# EAGLE design InrushTimer (EAGLE 7.7.0)
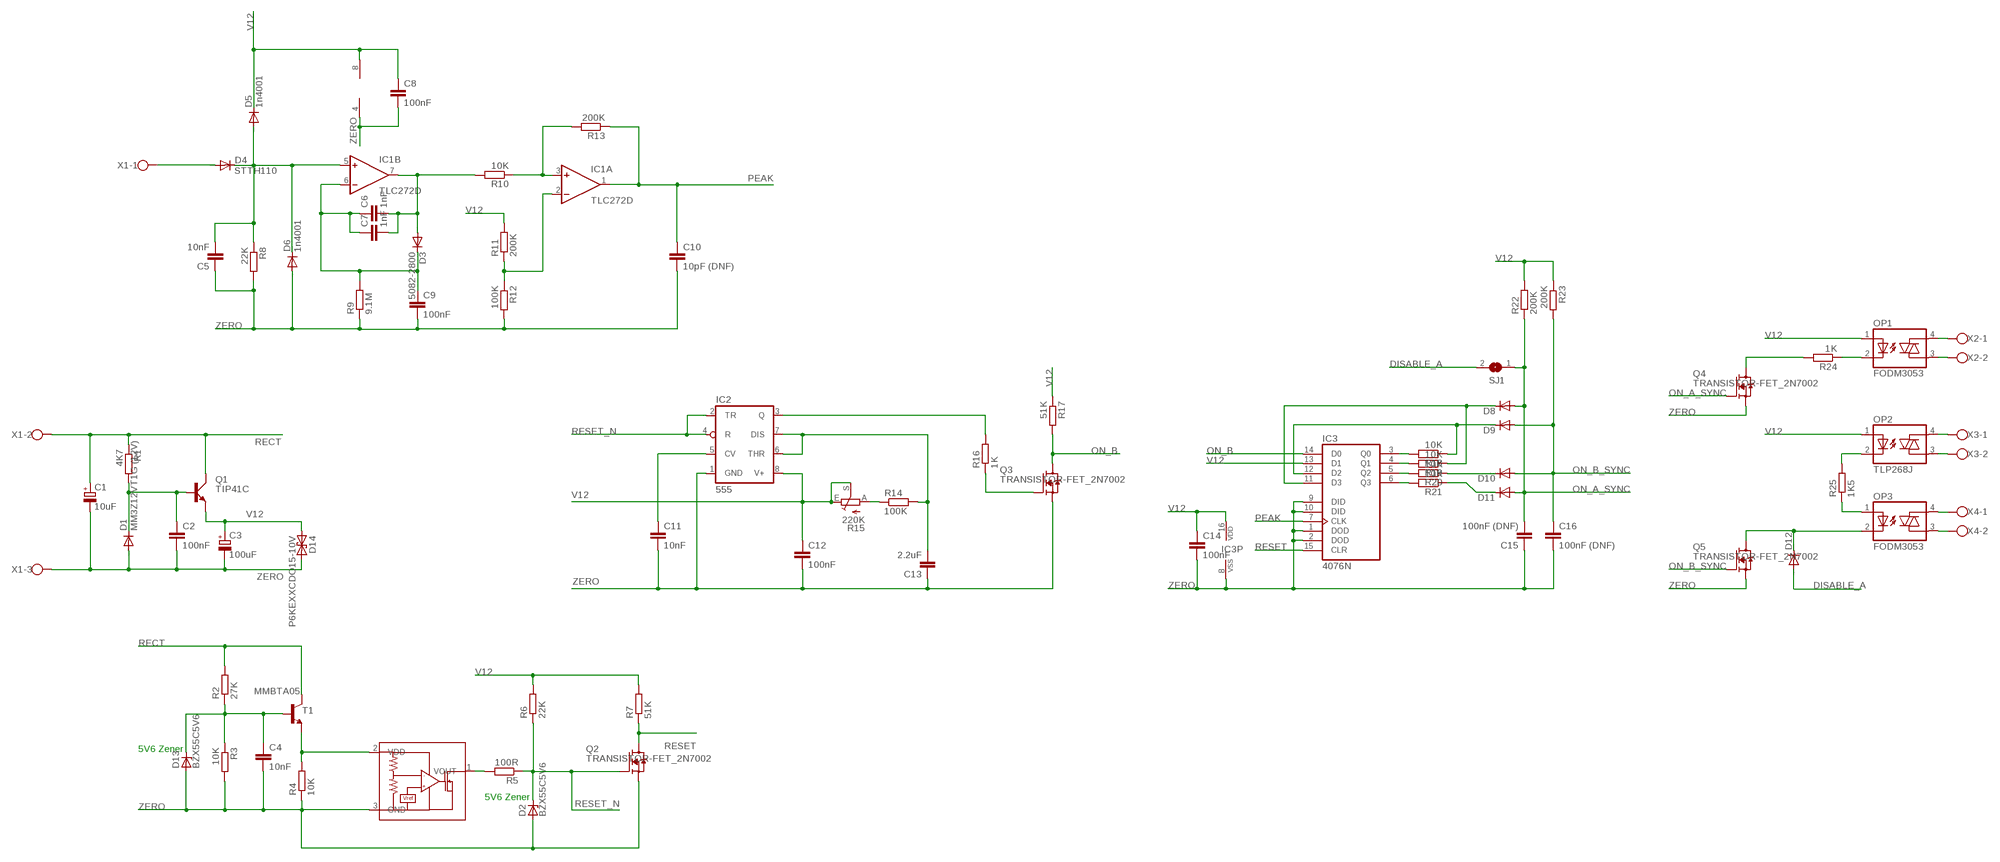
[diagram p0: schematic, sheet 1]

## Parts
C1  10uF  CPOL-EUE2-5  [E2-5]
C2  100nF  C-EU050-024X044  [C050-024X044]
C3  100uF  CPOL-EUE2.5-7  [E2,5-7]
C4  10nF  C-EU050-024X044  [C050-024X044]
C5  10nF  C-EUC0805K  [C0805K]
C6  1nF  C-EUC0805K  [C0805K]
C7  1nF  C-EUC0805K  [C0805K]
C8  100nF  C-EUC0805  [C0805]
C9  100nF  C-EUC1206K  [C1206K]
C10  10pF (DNF)  C-EUC0805K  [C0805K]
C11  10nF  C-EU050-024X044  [C050-024X044]
C12  100nF  C-EU050-024X044  [C050-024X044]
C13  2.2uF  C-EUC1206K  [C1206K]
C14  100nF  C-EU050-024X044  [C050-024X044]
C15  100nF (DNF)  C-EUC1206K  [C1206K]
C16  100nF (DNF)  C-EUC1206K  [C1206K]
D1  MM3Z12VT1G (12V)  DIODE-SOD323-R  [SOD323-R]
D2  BZX55C5V6  ZENER-DIODEDO34-7  [DO34Z7]
D3  5082-2800  DIODE-DO34-7  [DO34-7]
D4  STTH110  DIODE-DO41-7.6  [DO41-7.6]
D5  1n4001  DIODE-DO41-10VN  [DO41-10VN]
D6  1n4001  DIODE-DO41-7.6  [DO41-7.6]
D8  1N4148DO35-10  [DO35-10]
D9  1N4148DO35-7  [DO35-7]
D10  1N4148DO35-7  [DO35-7]
D11  1N4148DO35-7  [DO35-7]
D12  1N4148DO35-7  [DO35-7]
D13  BZX55C5V6  ZENER-DIODEDO34-7  [DO34Z7]
D14  P6KEXXCDO15-10V  [DO15-10V]
IC1  TLC272D  [SO08]
IC2  555  [SO08-555]
IC3  4076N  [DIL16]
OP1  FODM3053  [FODM]
OP2  TLP268J  [TLP26*]
OP3  FODM3053  [FODM]
Q1  TIP41C  [TO220AV]
Q2  TRANSISTOR-FET_2N7002  [TRANSISTOR-FET_SOT23]
Q3  TRANSISTOR-FET_2N7002  [TRANSISTOR-FET_SOT23]
Q4  TRANSISTOR-FET_2N7002  [TRANSISTOR-FET_SOT23]
Q5  TRANSISTOR-FET_2N7002  [TRANSISTOR-FET_SOT23]
R1  4K7  R-EU_0207/2V  [0207/2V]
R2  27K  R-EU_0207/7  [0207/7]
R3  10K  R-EU_0207/2V  [0207/2V]
R4  10K  R-EU_R0805  [R0805]
R5  100R  R-EU_0207/7  [0207/7]
R6  22K  R-EU_0207/2V  [0207/2V]
R7  51K  R-EU_0207/2V  [0207/2V]
R8  22K  R-EU_0207/2V  [0207/2V]
R9  9.1M  R-EU_0207/7  [0207/7]
R10  10K  R-EU_0207/10  [0207/10]
R11  200K  R-EU_0207/2V  [0207/2V]
R12  100K  R-EU_0207/2V  [0207/2V]
R13  200K  R-EU_0207/2V  [0207/2V]
R14  100K  R-EU_0207/2V  [0207/2V]
R15  220K  TRIM_EU-CA6H  [CA6H]
R16  1K  R-EU_R0402  [R0402]
R17  51K  R-EU_0207/2V  [0207/2V]
R18  10K  R-EU_R0805  [R0805]
R19  10K  R-EU_R0805  [R0805]
R20  10K  R-EU_R0805  [R0805]
R21  10K  R-EU_R0805  [R0805]
R22  200K  R-EU_0207/2V  [0207/2V]
R23  200K  R-EU_0207/7  [0207/7]
R24  1K  R-EU_0207/7  [0207/7]
R25  1K5  R-EU_0207/2V  [0207/2V]
SJ1  SJ  [SJ]
T1  MMBTA05  MMBTA42LT1-NPN-SOT23-BEC  [SOT23-BEC]
U1  ROHM_BY_ELEMENT14_BATCH_1_BU48XXG  [ROHM_BY_ELEMENT14_BATCH_1_SOT95P280X125-5N]
X1  W237-103  [W237-103]
X2  W237-102  [W237-102]
X3  W237-102  [W237-102]
X4  W237-102  [W237-102]

## Nets
DISABLE_A: D12.A SJ1.2
N$1: D4.A X1.1
N$2: R14.1 R15.A
N$3: IC3.6(Q3) R21.2
N$4: OP3.4(A2) X4.1
N$5: OP1.3(A1) X2.2
N$6: D12.C OP3.2(C) Q5.3(D)
N$7: C6.2 C7.2 D3.A IC1.7(B:OUT) R10.2
N$8: C2.1 D1.C Q1.B R1.2
N$9: C6.1 C7.1 C9.1 D3.C IC1.6(B:-IN) R9.2
N$10: OP1.4(A2) X2.1
N$11: C5.2 D4.C D5.A D6.C IC1.5(B:+IN) R8.1
N$12: OP3.3(A1) X4.2
N$13: R4.2 T1.E U1.2(VDD)
N$14: C4.1 D13.C R2.1 R3.1 T1.B
N$15: OP3.1(A) R25.1
N$16: D9.C IC3.12(D2) R18.1
N$17: OP2.2(C) R25.2
N$18: OP1.2(C) R24.1
N$19: IC3.5(Q2) R20.2
N$20: OP2.4(A2) X3.1
N$21: OP2.3(A1) X3.2
N$22: D8.C IC3.11(D3) R19.1
N$23: R5.2 U1.1(VOUT)
N$24: D11.C R21.1
N$25: IC3.4(Q1) R19.2
N$26: IC1.3(A:+IN) R10.1 R13.2
N$28: C13.2 IC2.6(THR) IC2.7(DIS) R14.2
N$30: D10.C R20.1
N$31: Q4.3(D) R24.2
N$32: IC3.3(Q0) R18.2
N$36: Q3.1(G) R16.1
N$40: C11.1 IC2.5(CV)
N$48: IC2.3(Q) R16.2
ON_A_SYNC: C15.2 D8.A D11.A Q4.1(G) R22.1 SJ1.1
ON_B: IC3.14(D0) Q3.3(D) R17.2
ON_B_SYNC: C16.1 D9.A D10.A Q5.1(G) R23.2
PEAK: C10.1 IC1.1(A:OUT) IC3.7(CLK) R13.1
RECT: C1.+ Q1.C R1.1 R2.2 T1.C X1.2
RESET: IC3.15(CLR) Q2.3(D) R7.1
RESET_N: D2.C IC2.2(TR) IC2.4(R) Q2.1(G) R5.1 R6.1
THRESH: IC1.2(A:-IN) R11.1 R12.1
V12: C3.+ C8.1 C12.1 C14.1 D5.C D14.A IC1.8(P:V+) IC2.8(V+) IC3.13(D1) IC3.16(VDD) OP1.1(A) OP2.1(A) Q1.E R6.2 R7.2 R11.2 R15.E R15.S R17.1 R22.2 R23.1
ZERO: C1.- C2.2 C3.- C4.2 C5.1 C8.2 C9.2 C10.2 C11.2 C12.2 C13.1 C14.2 C15.1 C16.2 D1.A D2.A D6.A D13.A D14.C IC1.4(P:V-) IC2.1(GND) IC3.1(DOD) IC3.2(DOD) IC3.8(VSS) IC3.9(DID) IC3.10(DID) Q2.2(S) Q3.2(S) Q4.2(S) Q5.2(S) R3.2 R4.1 R8.2 R9.1 R12.2 U1.3(GND) X1.3

## Notes on the sheet
- 5V6 Zener
- 5V6 Zener

## Library data of the parts
C1 C3 = rcl:CPOL-EU: POLARIZED CAPACITOR, European symbol
C2 C4-C16 = rcl:C-EU: CAPACITOR, European symbol
D1 D3-D6 = diode:DIODE-: DIODE
D2 D13 = diode:ZENER-DIODE: Z-Diode
D8-D12 = diode:1N4148: DIODE high speed (Philips)
D14 = diode:P6KEXXC: DIODE transient-voltage suppressor
IC1 = linear:TLC272: OP AMP
IC2 = linear:*555: TIMER
IC3 = 40xx:4076: Quad D-type REGISTER
OP1 OP3 = SHoleLib:FODM3053
OP2 = SHoleLib:TLP268J
Q1 = transistor-power:TIP41C: NPN TRANSISTOR
Q2-Q5 = InrushTimer:TRANSISTOR-FET_2N7002
R1-R14 R16-R25 = rcl:R-EU_: RESISTOR, European symbol
R15 = pot:TRIM_EU-: POTENTIOMETER
SJ1 = jumper:SJ: SMD solder JUMPER
T1 = transistor:*-NPN-: NPN Transistror BF959 corrected 2008.03.06
U1 = InrushTimer:ROHM_BY_ELEMENT14_BATCH_1_BU48XXG
X1 = con-wago-500:W237-103: WAGO SCREW CLAMP; MPN: 237-103; OC_FARNELL: unknown; OC_NEWARK: 18M7116
X2-X4 = con-wago-500:W237-102: WAGO SCREW CLAMP; MPN: 237-102; OC_FARNELL: unknown; OC_NEWARK: 70K9898

## Net classes
1 Power: width 1.27 mm, clearance 0.381 mm
3 Ground: width 0.318 mm, clearance 0.381 mm

## Board
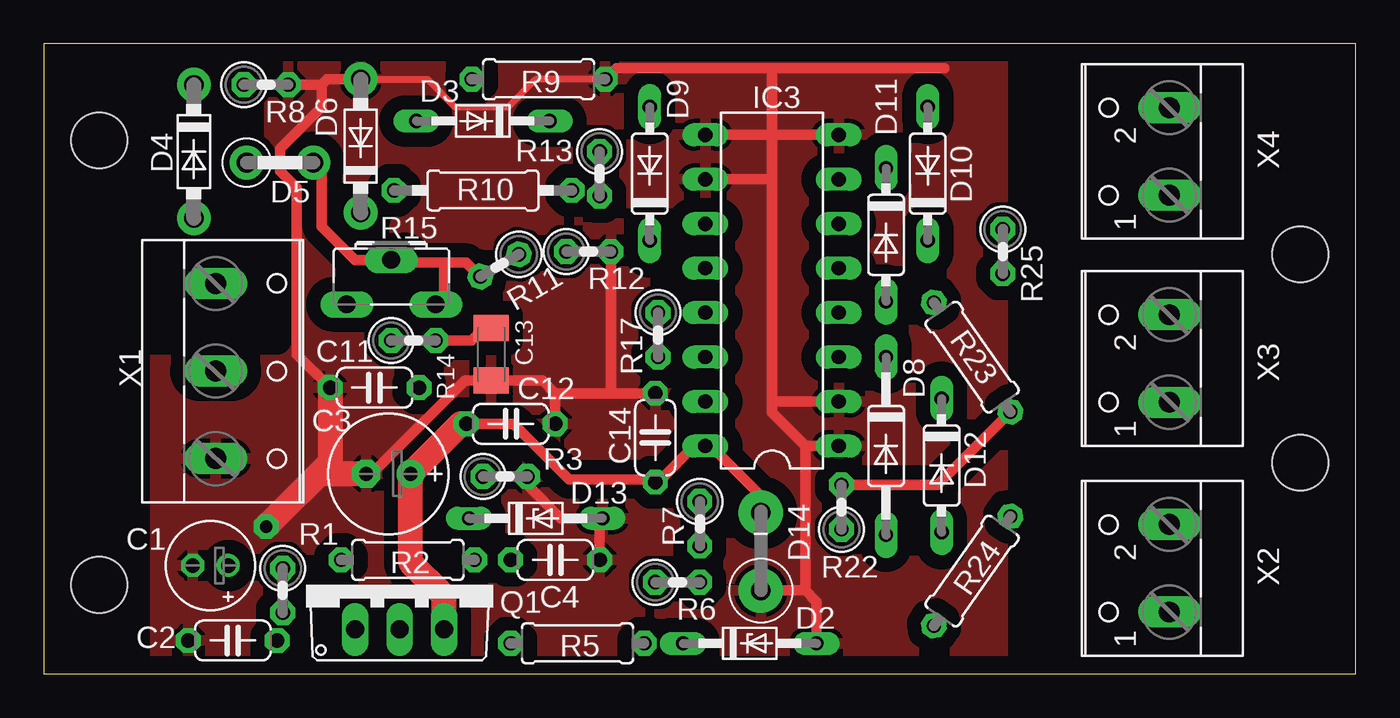
[diagram p1: board, top side]
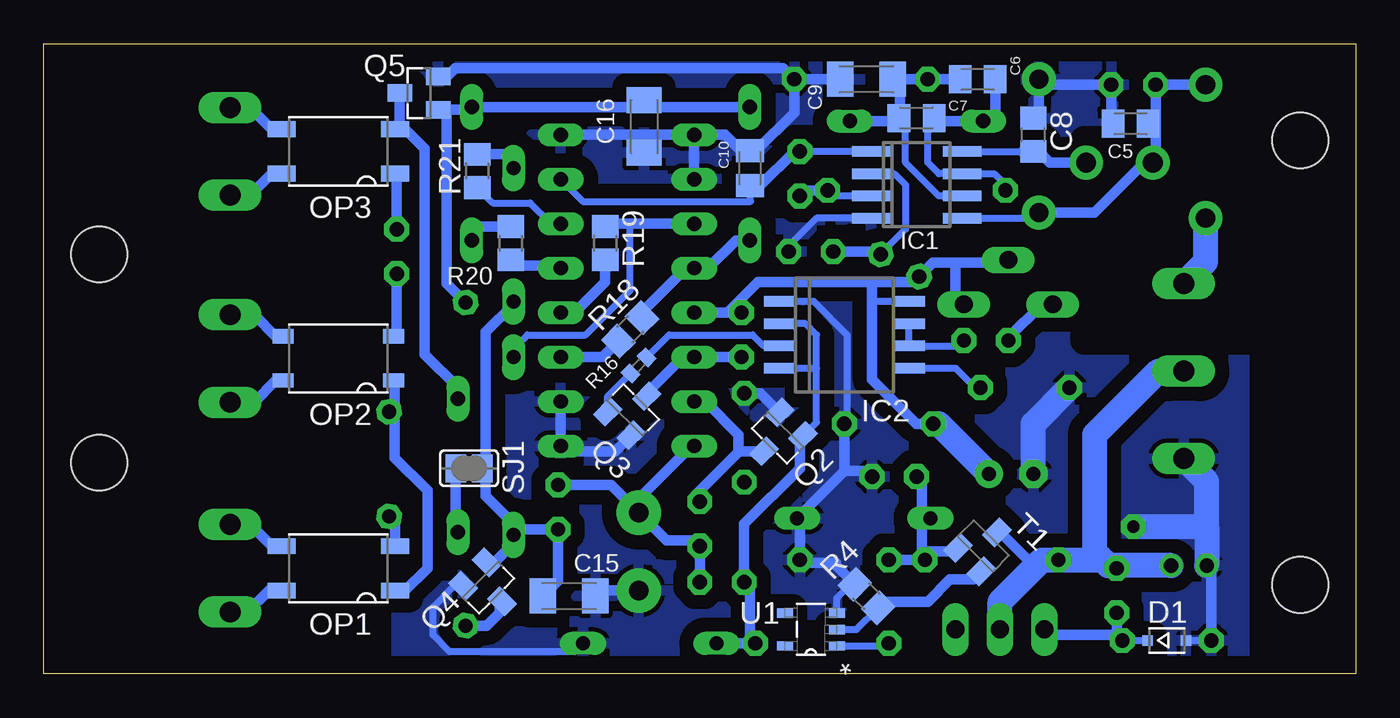
[diagram p2: board, bottom side, seen from below]

Size 74.93 x 36 mm. Coordinates in mm from the lower left corner, seen from the top.
Outline: 0,0 74.93,0 74.93,36 0,36 0,0
Copper layers (1*16): Top 0.035mm / dielectric 1.5mm / Bottom 0.035mm
Design rules "default *": minimum track width 16mil, minimum drill 24mil, track to track 16mil, track to pad 16mil, pad to pad 16mil, via to via 16mil, smd to smd 12.5mil, copper to edge 40mil, drill to drill 8mil, minimum pad ring 10mil, minimum via ring 8mil, stop-mask expansion 4mil, vias tented up to drill 0mil, thermal gap 10mil
Holes 3.2 mm at 71.75,12.06 71.75,23.97 3.17,30.48 3.17,5.08
tRestrict: area 55.9,0 to 68.6,36; area 6.3,27.9 to 11.7,36; area 6.4,19.1 to 13.3,27.9
bRestrict: area 55.9,0 to 68.6,36; area 6.4,19.1 to 15.5,30.5

### Footprints (pad centres in the part's own frame; a part is rotated, then mirrored left to right if it is on the bottom)
E2-5 = drill 0.813 pad 1.27: + -1.016,0 | drill 0.813 pad 1.27 octagon: - 1.016,0
C050-024X044 = drill 0.813 pad 1.422 octagon: 1 -2.54,0; 2 2.54,0
E2,5-7 = drill 0.813 pad 1.6: + -1.27,0 | drill 0.813 pad 1.6 octagon: - 1.27,0
C0805K = smd 1.3 x 1.6: 1 -1,0; 2 1,0
C0805 = smd 1.3 x 1.5: 1 -0.95,0; 2 0.95,0
C1206K = smd 1.5 x 2: 1 -1.5,0; 2 1.5,0
SOD323-R = smd 0.6 x 0.6: A 1.1,0; C -1.1,0
DO34Z7 = drill 0.813 long: A 3.81,0; C -3.81,0
DO34-7 = drill 0.813 long: A 3.81,0; C -3.81,0
DO41-7.6 = drill 1.1 pad 1.93: A 3.81,0; C -3.81,0
DO41-10VN = drill 1.118 pad 1.93: A 1.905,0; C -1.905,0
DO35-10 = drill 0.813 long: A 5.08,0; C -5.08,0
DO35-7 = drill 0.813 long: A 3.81,0; C -3.81,0
DO15-10V = drill 1.118 pad 2.54: A 2.223,0; C -2.223,0
SO08 = smd 0.6 x 2.2: 1 -1.905,-2.6; 2 -0.635,-2.6; 3 0.635,-2.6; 4 1.905,-2.6; 5 1.905,2.6; 6 0.635,2.6; 7 -0.635,2.6; 8 -1.905,2.6
SO08-555 = smd 0.6 x 1.8: 1 -1.905,-3.7; 2 -0.635,-3.7; 3 0.635,-3.7; 4 1.905,-3.7; 5 1.905,3.7; 6 0.635,3.7; 7 -0.635,3.7; 8 -1.905,3.7
DIL16 = drill 0.813 long: 1 -8.89,-3.81; 2 -6.35,-3.81; 3 -3.81,-3.81; 4 -1.27,-3.81; 5 1.27,-3.81; 6 3.81,-3.81; 7 6.35,-3.81; 8 8.89,-3.81; 9 8.89,3.81; 10 6.35,3.81; 11 3.81,3.81; 12 1.27,3.81; 13 -1.27,3.81; 14 -3.81,3.81; 15 -6.35,3.81; 16 -8.89,3.81
FODM = smd 0.9 x 1.6: 1 -1.27,-3.25; 2 1.27,-3.25; 3 1.27,3.25; 4 -1.27,3.25
TLP26* = smd 0.8 x 1.2: 1 -1.27,-3.15; 2 1.27,-3.15; 3 1.27,3.15; 4 -1.27,3.15
TO220AV = drill 1.016 long: B -2.54,-2.54; C 0,-2.54; E 2.54,-2.54
TRANSISTOR-FET_SOT23 = smd 1 x 1.4: 1 -0.95,-1.1; 2 0.95,-1.1; 3 0,1.1
0207/2V = drill 0.813 pad 1.422 octagon: 1 -1.27,0; 2 1.27,0
0207/7 = drill 0.813 pad 1.422 octagon: 1 -3.81,0; 2 3.81,0
R0805 = smd 1.3 x 1.5: 1 -0.95,0; 2 0.95,0
0207/10 = drill 0.813 pad 1.422 octagon: 1 -5.08,0; 2 5.08,0
CA6H = drill 1.016 long: A -2.54,0; E 2.54,0; S 0,2.54
R0402 = smd 0.7 x 0.9: 1 -0.65,0; 2 0.65,0
SJ = smd 1.168 x 1.6: 1 -0.762,0; 2 0.762,0
SOT23-BEC = smd 1 x 1.4: B -0.95,-1.1; C 0,1.1; E 0.95,-1.1
ROHM_BY_ELEMENT14_BATCH_1_SOT95P280X125-5N = smd 0.914 x 0.533: 1 -1.473,0.94; 2 -1.473,0; 3 -1.473,-0.94; 4 1.473,-0.94; 5 1.473,0.94
W237-103 = drill 1.194 long: 1 -5,-1.29; 2 0,-1.29; 3 5,-1.29
W237-102 = drill 1.194 long: 1 -2.5,-1.27; 2 2.5,-1.27

### Placement (x,y rotation side)
C1  9.53,6.19 180 top
C2  10.79,1.91 180 top
C3  19.68,11.43 180 top
C4  29.21,6.51 0 top
C5  12.86,31.43 0 bottom
C6  21.59,33.97 0 bottom
C7  25.08,31.75 0 bottom
C8  18.41,30.8 90 bottom
C9  27.94,33.97 180 bottom
C10  34.61,28.89 90 bottom
C11  18.89,16.35 180 top
C12  26.67,14.29 0 top
C13  25.56,18.26 90 top
C14  34.92,13.49 90 top
C15  44.93,4.45 180 bottom
C16  40.64,31.27 270 bottom
D1  10.79,1.91 0 bottom
D2  40.32,1.75 0 top
D3  25.08,31.59 180 top
D4  8.57,29.84 270 top
D5  13.49,29.21 180 top
D6  18.1,30.16 90 top
D8  48.1,13.02 270 top
D9  34.61,28.57 90 top
D10  50.48,28.57 90 top
D11  48.1,25.08 270 top
D12  51.28,11.91 270 top
D13  28.1,8.89 0 top
D14  40.96,6.99 90 top
IC1  25.08,27.94 270 bottom
IC2  29.21,19.37 270 bottom
IC3  41.59,21.91 90 top
OP1  58.1,6.03 90 bottom
OP2  58.1,18.02 90 bottom
OP3  58.1,29.84 90 bottom
Q1  20.32,5.08 0 top
Q2  33.02,13.49 135 bottom
Q3  41.27,15.08 315 bottom
Q4  49.53,4.92 225 bottom
Q5  53.5,33.18 90 bottom
R1  13.65,4.76 270 top
R2  20.8,6.51 180 top
R3  26.35,11.27 0 top
R4  27.94,4.45 315 bottom
R5  30.48,1.75 180 top
R6  36.2,5.24 0 top
R7  37.47,8.57 270 top
R8  12.7,33.66 0 top
R9  28.26,33.97 180 top
R10  25.08,27.62 180 top
R11  26.04,23.34 210 top
R12  31.11,24.13 0 top
R13  31.75,28.57 270 top
R14  21.11,19.05 0 top
R15  19.84,21.11 0 top
R16  40.96,17.62 45 bottom
R17  35.08,19.37 270 top
R18  41.43,19.68 225 bottom
R19  42.86,24.61 270 bottom
R20  48.26,24.61 270 bottom
R21  50.16,28.73 270 bottom
R22  45.56,9.53 90 top
R23  53.02,18.1 125 top
R24  53.02,5.87 235 top
R25  54.77,24.13 270 top
SJ1  50.64,11.75 180 bottom
T1  21.27,7.3 315 bottom
U1  31.11,2.54 180 bottom
X1  11.11,17.3 270 top
X2  63.02,6.03 90 top
X3  63.02,18.02 90 top
X4  63.02,29.84 90 top

### Tracks (layer width: path | path; a pad name or v marks a point on that pad's centre or on a via)
DISABLE_A
  Bottom 0.61: D12.A 51.4,8.22 SJ1.2
N$1
  Bottom 1.422: X1.1 8.57,23.55 D4.A
N$2
  Bottom 0.61: R15.A 17.94,21.11 19.84,19.21 R14.1
N$3
  Bottom 0.406: IC3.6 45.96,25.72 47.15,26.91 49.29,26.91 R21.2
N$4
  Bottom 0.61: X4.1 63.14,27.34 61.91,28.57 OP3.4
N$5
  Bottom 0.61: X2.2 63.14,8.53 61.91,7.3 OP1.3
N$6
  Bottom 0.61: Q5.3 54.6,31.37 OP3.2 54.29,31.11 53.18,30 53.18,18.26 51.28,16.35 D12.C
N$7
  Bottom 0.406: R10.2 20,27.94 20.64,28.57 IC1.7 23.81,28.57 24.45,29.21 24.45,31.75 C7.2
  Bottom 0.61: C6.2 20.59,31.59 D3.A 24.08,31.59 C7.2
N$8
  Bottom 0.406: C2.1 D1.C
  Bottom 0.61: R1.2 13.65,2.22 | 13.65,2.22 C2.1 | 13.65,2.22 17.46,2.22 Q1.B
N$9
  Bottom 0.406: IC1.6 23.81,27.3 25.72,29.21 25.72,31.75 26.04,31.75 C7.1
  Bottom 0.61: C9.1 26.04,33.97 | 26.04,33.97 26.04,31.75 26.04,31.59 26.08,31.59 | C6.1 R9.2 26.04,33.97 | D3.C 26.08,31.59 | 26.08,31.59 C7.1
N$10
  Bottom 0.61: X2.1 63.3,3.53 62.07,4.76 OP1.4
N$11
  Bottom 0.406: IC1.5 18.41,26.04 D6.C
  Bottom 0.61: D6.C 14.92,26.35 12.06,29.21 D5.A 11.43,29.21 11.43,31.11 | 11.43,31.11 R8.1 D4.C | C5.2 11.54,31.11 11.43,31.11
N$12
  Bottom 0.61: X4.2 63.14,32.34 61.91,31.11 OP3.3
N$13
  Bottom 0.406: U1.2 28.5,2.54 R4.2
  Bottom 0.61: R4.2 26.91,4.13 24.45,4.13 23.18,5.4 21.83,5.4 T1.E
N$14
  Bottom 0.61: 24.77,6.99 24.77,6.51 R2.1 C4.1 | 24.77,6.99 24.77,8.89 | 24.77,8.89 24.77,11.27 R3.1 | D13.C 24.77,8.89 | T1.B 22.72,6.99 24.77,6.99
N$15
  Bottom 0.61: R25.1 54.77,28.49 OP3.1
N$16
  Bottom 0.61: R18.1 40.76,20.67 38.26,23.18 IC3.12 36.99,23.18 35.4,24.77 D9.C
N$17
  Bottom 0.61: OP2.2 54.77,19.47 R25.2
N$18
  Bottom 0.61: R24.1 54.85,8.99 OP1.2
N$19
  Bottom 0.61: R20.2 47.94,23.34 45.4,23.34 IC3.5
N$20
  Bottom 0.61: X3.1 62.9,15.52 61.67,16.75 OP2.4
N$21
  Bottom 0.61: X3.2 62.9,20.52 61.67,19.29 OP2.3
N$22
  Bottom 0.406: D8.C 48.1,18.57 47.31,19.37 43.97,19.37 41.43,21.91 41.43,25.72
  Bottom 0.61: IC3.11 41.43,25.72 42.86,25.72 R19.1
N$23
  Bottom 0.406: U1.1 26.67,1.6 R5.2
N$24
  Bottom 0.61: R21.1 48.1,29.68 D11.C
N$25
  Bottom 0.61: IC3.4 44.61,20.64 42.86,22.38 R19.2
N$26
  Bottom 0.406: IC1.3 29.84,27.3 R10.1
  Bottom 0.61: R13.2 31.43,27.62 R10.1
N$28
  Top 0.61: R14.2 24.45,19.05 25.15,19.76 C13.2
  Bottom 0.406: IC2.7 IC2.6 22.38,18.73 R14.2
N$30
  Bottom 0.61: R20.1 50.48,25.56 | 50.48,25.56 | 50.48,25.56 D10.C
N$31
  Bottom 0.61: 48.97,4.14 Q4.3 48.9,4 48.9,3.49 49.63,2.75 R24.2
N$32
  Bottom 0.61: IC3.3 43.02,18.1 R18.2
N$36
  Bottom 0.406: Q3.1 42.73,15.85 R16.1
N$40
  Bottom 0.406: IC2.5 22.86,17.46 21.75,16.35 C11.1
N$48
  Bottom 0.406: IC2.3 33.81,18.73 34.45,19.37 39.21,19.37 R16.2
ON_A_SYNC
  Bottom 0.61: 49.85,11.78 SJ1.1 49.69,11.75 | 49.69,11.75 49.69,19.53 48.1,21.11 D11.A | 49.69,11.75 49.69,10.16 48.1,8.57 D8.A | Q4.1 49.64,6.4 49.16,6.4 48.1,7.46 D8.A | 48.1,7.87 D8.A | C15.2 45.56,5.31 R22.1 48.1,8.26 D8.A
ON_B
  Bottom 0.61: R17.2 IC3.14 38.42,18.1 40.5,16.02 Q3.3
ON_B_SYNC
  Bottom 0.61: Q5.1 51.91,32.23 | 51.91,32.23 50.64,32.23 D10.A 40.64,32.38 | 51.91,32.23 51.91,22.29 R23.2 | C16.1 40.64,32.38 | 40.64,32.38 D9.A
PEAK
  Bottom 0.406: IC3.7 44.13,26.99 34.56,26.99 C10.1 | IC1.1 R13.1
  Bottom 0.61: C10.1 34.02,27.89 32.07,29.84 R13.1
RECT
  Bottom 0.61: T1.C 20.3,8.08 18.34,6.11
  Bottom 1.422: C1.+ 13.81,6.19 | 14.45,6.51 14.61,6.67 | 14.61,6.67 14.92,6.67 14.92,13.65 11.27,17.3 X1.2 | R1.1 13.81,6.19 | 13.81,6.19 14.13,6.19 14.45,6.51 | 14.61,6.51 14.61,6.67 | 14.45,6.51 R2.2 17.94,6.51 18.34,6.11 20.32,4.13 Q1.C
RESET
  Bottom 0.61: R7.1 37.47,10.48 35.23,12.72 | IC3.15 37.15,15.56 35.24,13.65 35.24,12.73 35.23,12.72 | 35.23,12.72 Q2.3
RESET_N
  Bottom 0.406: IC2.2 31.43,20 30.8,19.37 30.8,17.46 | Q2.1 30.8,14.37 30.8,17.46 | IC2.4 30.8,17.46
  Bottom 0.61: D2.C 34.61,1.75 | 34.61,1.75 34.61,4.92 R6.1 34.92,8.57 31.75,11.75 31.75,13.42 Q2.1 | 34.61,1.75 R5.1
THRESH
  Bottom 0.406: IC1.2 26.35,28.57 25.72,27.94 25.72,25.4 27.14,23.98 R11.1
  Bottom 0.61: R12.1 27.29,24.13 R11.1
V12
  Top 0.61: C12.1 26.83,14.29 30,11.11 34.92,11.11 | 34.92,11.11 35.24,11.11 37.15,13.02 IC3.16 38.1,13.02 40.96,10.16 D14.A | R22.2 51.03,10.79 R23.1 | 22.86,23.5 24.13,23.5 24.92,22.7 | 22.86,23.5 20,23.5 R15.S 17.78,23.65 15.88,25.56 15.88,29.21 D5.C | R15.E 22.86,21.11 22.86,23.5 | C14.1 34.92,11.11
  Top 1.422: Q1.E 22.86,4.45 20.95,6.35 C3.+ 23.81,14.29 C12.1
  Bottom 0.406: IC1.8 19.05,29.84 C8.1 | IC2.8 27.62,21.27 27.62,21.59
  Bottom 0.61: C8.1 18.42,30.16 18.41,30.16 | 19.05,29.84 18.1,29.84 17.46,29.21 D5.C | 27.62,22.38 34.13,22.38 35.88,20.64 | 35.88,20.64 IC3.13 | R17.1 35.88,20.64 | 54.77,16.75 OP2.1 54.89,16.69 54.89,14.92 | 27.62,22.38 27.62,21.59 27.62,16.83 25.08,14.29 C12.1 | OP1.1 54.29,4.76 53.02,6.03 53.02,10.48 54.89,12.35 54.89,14.92 | 22.86,23.5 19.84,23.5 R15.S | R15.E 22.86,21.11 22.86,23.5 | 22.86,23.5 24.14,23.5 R11.2 24.93,22.38 27.62,22.38 | R6.2 R7.2 37.47,7.62 39.37,7.62 D14.A | IC3.16 37.94,13.02 40.96,10 D14.A | R22.2 42.55,10.79 D14.A | R23.1 54.94,14.98 54.89,14.92
  Bottom 1.422: C3.+ 23.81,14.29 C12.1
ZERO  (via drill 0.7 pad 1.42)
  Top 0.406: D6.A 21.91,33.97 23.5,32.38 26.51,32.38 28.1,33.97 R9.1
  Top 0.61: 41.59,28.26 41.59,14.92 43.5,13.02 | IC3.10 41.59,28.26 | IC3.9 41.59,30.8 | 41.59,30.8 IC3.8 45.72,30.48 | 41.59,28.26 41.59,30.8 | IC3.1 43.5,13.02 | IC3.2 41.75,15.56 | C14.2 32.38,16.03 | 32.38,16.03 29.21,16.03 | R9.1 32.7,34.61 41.59,34.61 | 41.59,34.61 51.44,34.61 | C12.2 29.21,16.03 | 29.21,16.03 28.49,16.76 C13.1 24.06,16.76 18.73,11.43 17.78,11.43 | C11.2 14.45,18.26 14.45,27.78 13.49,28.73 13.49,30 15.88,32.38 15.88,33.66 | 43.5,13.02 43.5,4.76 | D2.A 44.13,4.13 43.5,4.76 | 41.59,30.8 41.59,34.61 | R12.2 32.38,16.03 | 31.75,6.35 31.75,8.89 D13.A 29.53,8.89 27.62,10.79 R3.2 | 43.5,4.76 D14.C | D6.A 16.19,33.97 15.88,33.66 | 15.88,33.66 R8.2
  Top 1.422: v12.7,8.41 16.35,12.06 C11.2 | C3.- 17.78,11.43 15.88,11.43
  Bottom 0.406: D1.A C2.2 | IC2.1 30.96,21.27 29.05,19.37 29.05,14.29 C12.2 | IC1.4 30.8,26.04 32.38,24.45 | U1.3 29.64,4.33 28.86,5.12 R4.1 | D2.A 44.61,1.27 51.75,1.27 52.7,2.22 52.7,3.81 51.49,5.03 Q4.2
  Bottom 0.61: R9.1 C9.2 | IC3.2 IC3.1 45.4,12.7 42.31,12.7 Q3.2 | R9.1 32.7,34.61 51.44,34.61 51.91,34.13 Q5.2 | IC3.8 40.64,30.8 | 40.64,30.8 IC3.9 | C16.2 40.64,30.8 | IC3.9 36.04,30.8 35.13,29.89 C10.2 34.24,29.89 32.07,32.07 R9.1 | IC3.9 IC3.10 | 13.81,31.43 C5.1 13.97,31.43 R8.2 18.1,33.66 D6.A 18.1,31.75 C8.2 | C2.2 8.26,6.19 C1.- | R4.1 29.69,6.19 29.69,6.35 31.59,6.35 C4.2 31.75,8.89 D13.A 29.21,11.59 | 29.21,13.97 C12.2 29.21,11.59 | 43.5,1.75 D2.A | 29.21,11.59 27.62,11.59 R3.2 | D14.C 43.43,4.76 C15.1 | Q2.2 34,16.03 C14.2
  Bottom 1.422: 8.51,8.41 8.51,10.99 X1.3 | v12.7,8.41 8.51,8.41 | 8.51,8.41 C1.- | C3.- 18.41,14.29 C11.2
  pour Top (isolate 0.813): 6.35,0 68.58,0 68.58,36 6.35,36
  pour Bottom (isolate 0.813): 6.35,0 68.58,0 68.58,36 6.35,36